# Altium schematic sheet button.SchDoc
size A4
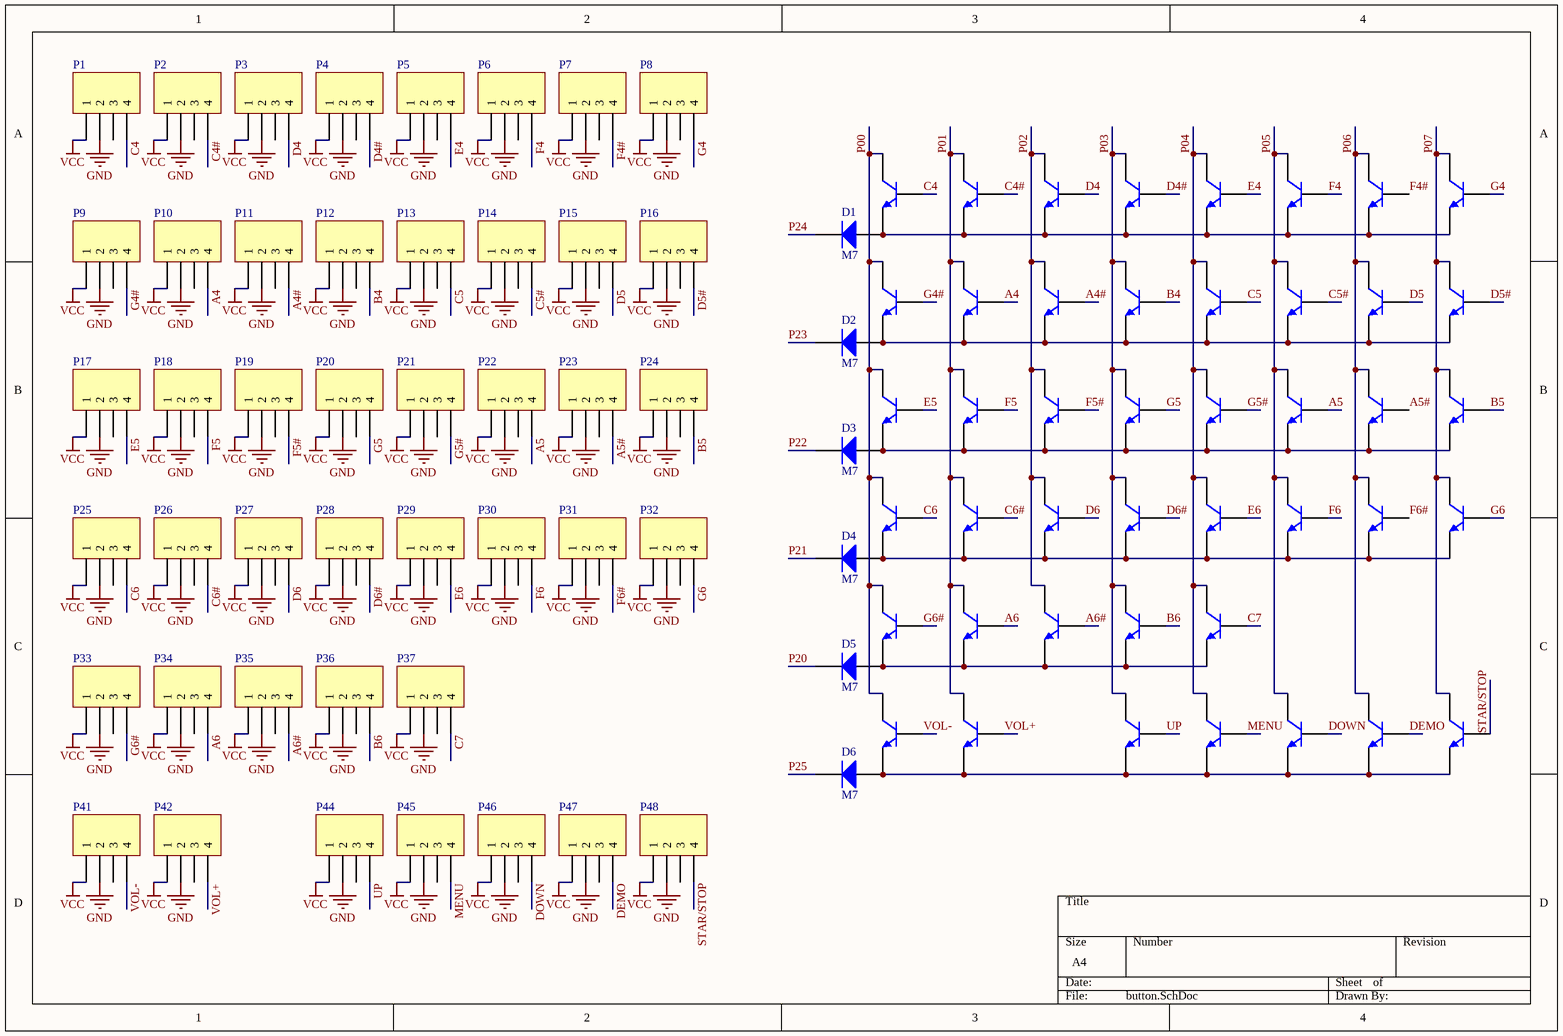
[diagram p0: button.SchDoc]

## Parts
D1  M7  [SMA(DO-214AC)_S1]
D2  M7  [SMA(DO-214AC)_S1]
D3  M7  [SMA(DO-214AC)_S1]
D4  M7  [SMA(DO-214AC)_S1]
D5  M7  [SMA(DO-214AC)_S1]
D6  M7  [SMA(DO-214AC)_S1]
P1  Header 4  [FPC1.0-2H-WS-4P]  (value not drawn)
P2  Header 4  [FPC1.0-2H-WS-4P]  (value not drawn)
P3  Header 4  [FPC1.0-2H-WS-4P]  (value not drawn)
P4  Header 4  [FPC1.0-2H-WS-4P]  (value not drawn)
P5  Header 4  [FPC1.0-2H-WS-4P]  (value not drawn)
P6  Header 4  [FPC1.0-2H-WS-4P]  (value not drawn)
P7  Header 4  [FPC1.0-2H-WS-4P]  (value not drawn)
P8  Header 4  [FPC1.0-2H-WS-4P]  (value not drawn)
P9  Header 4  [FPC1.0-2H-WS-4P]  (value not drawn)
P10  Header 4  [FPC1.0-2H-WS-4P]  (value not drawn)
P11  Header 4  [FPC1.0-2H-WS-4P]  (value not drawn)
P12  Header 4  [FPC1.0-2H-WS-4P]  (value not drawn)
P13  Header 4  [FPC1.0-2H-WS-4P]  (value not drawn)
P14  Header 4  [FPC1.0-2H-WS-4P]  (value not drawn)
P15  Header 4  [FPC1.0-2H-WS-4P]  (value not drawn)
P16  Header 4  [FPC1.0-2H-WS-4P]  (value not drawn)
P17  Header 4  [FPC1.0-2H-WS-4P]  (value not drawn)
P18  Header 4  [FPC1.0-2H-WS-4P]  (value not drawn)
P19  Header 4  [FPC1.0-2H-WS-4P]  (value not drawn)
P20  Header 4  [FPC1.0-2H-WS-4P]  (value not drawn)
P21  Header 4  [FPC1.0-2H-WS-4P]  (value not drawn)
P22  Header 4  [FPC1.0-2H-WS-4P]  (value not drawn)
P23  Header 4  [FPC1.0-2H-WS-4P]  (value not drawn)
P24  Header 4  [FPC1.0-2H-WS-4P]  (value not drawn)
P25  Header 4  [FPC1.0-2H-WS-4P]  (value not drawn)
P26  Header 4  [FPC1.0-2H-WS-4P]  (value not drawn)
P27  Header 4  [FPC1.0-2H-WS-4P]  (value not drawn)
P28  Header 4  [FPC1.0-2H-WS-4P]  (value not drawn)
P29  Header 4  [FPC1.0-2H-WS-4P]  (value not drawn)
P30  Header 4  [FPC1.0-2H-WS-4P]  (value not drawn)
P31  Header 4  [FPC1.0-2H-WS-4P]  (value not drawn)
P32  Header 4  [FPC1.0-2H-WS-4P]  (value not drawn)
P33  Header 4  [FPC1.0-2H-WS-4P]  (value not drawn)
P34  Header 4  [FPC1.0-2H-WS-4P]  (value not drawn)
P35  Header 4  [FPC1.0-2H-WS-4P]  (value not drawn)
P36  Header 4  [FPC1.0-2H-WS-4P]  (value not drawn)
P37  Header 4  [FPC1.0-2H-WS-4P]  (value not drawn)
P41  Header 4  [FPC1.0-2H-WS-4P]  (value not drawn)
P42  Header 4  [FPC1.0-2H-WS-4P]  (value not drawn)
P44  Header 4  [FPC1.0-2H-WS-4P]  (value not drawn)
P45  Header 4  [FPC1.0-2H-WS-4P]  (value not drawn)
P46  Header 4  [FPC1.0-2H-WS-4P]  (value not drawn)
P47  Header 4  [FPC1.0-2H-WS-4P]  (value not drawn)
P48  Header 4  [FPC1.0-2H-WS-4P]  (value not drawn)
Q1  SS8050 Y1  [SOT-23(SOT-23-3)]  (value not drawn)
Q2  SS8050 Y1  [SOT-23(SOT-23-3)]  (value not drawn)
Q3  SS8050 Y1  [SOT-23(SOT-23-3)]  (value not drawn)
Q4  SS8050 Y1  [SOT-23(SOT-23-3)]  (value not drawn)
Q5  SS8050 Y1  [SOT-23(SOT-23-3)]  (value not drawn)
Q6  SS8050 Y1  [SOT-23(SOT-23-3)]  (value not drawn)
Q7  SS8050 Y1  [SOT-23(SOT-23-3)]  (value not drawn)
Q8  SS8050 Y1  [SOT-23(SOT-23-3)]  (value not drawn)
Q9  SS8050 Y1  [SOT-23(SOT-23-3)]  (value not drawn)
Q10  SS8050 Y1  [SOT-23(SOT-23-3)]  (value not drawn)
Q11  SS8050 Y1  [SOT-23(SOT-23-3)]  (value not drawn)
Q12  SS8050 Y1  [SOT-23(SOT-23-3)]  (value not drawn)
Q13  SS8050 Y1  [SOT-23(SOT-23-3)]  (value not drawn)
Q14  SS8050 Y1  [SOT-23(SOT-23-3)]  (value not drawn)
Q15  SS8050 Y1  [SOT-23(SOT-23-3)]  (value not drawn)
Q16  SS8050 Y1  [SOT-23(SOT-23-3)]  (value not drawn)
Q17  SS8050 Y1  [SOT-23(SOT-23-3)]  (value not drawn)
Q18  SS8050 Y1  [SOT-23(SOT-23-3)]  (value not drawn)
Q19  SS8050 Y1  [SOT-23(SOT-23-3)]  (value not drawn)
Q20  SS8050 Y1  [SOT-23(SOT-23-3)]  (value not drawn)
Q21  SS8050 Y1  [SOT-23(SOT-23-3)]  (value not drawn)
Q22  SS8050 Y1  [SOT-23(SOT-23-3)]  (value not drawn)
Q23  SS8050 Y1  [SOT-23(SOT-23-3)]  (value not drawn)
Q24  SS8050 Y1  [SOT-23(SOT-23-3)]  (value not drawn)
Q25  SS8050 Y1  [SOT-23(SOT-23-3)]  (value not drawn)
Q26  SS8050 Y1  [SOT-23(SOT-23-3)]  (value not drawn)
Q27  SS8050 Y1  [SOT-23(SOT-23-3)]  (value not drawn)
Q28  SS8050 Y1  [SOT-23(SOT-23-3)]  (value not drawn)
Q29  SS8050 Y1  [SOT-23(SOT-23-3)]  (value not drawn)
Q30  SS8050 Y1  [SOT-23(SOT-23-3)]  (value not drawn)
Q31  SS8050 Y1  [SOT-23(SOT-23-3)]  (value not drawn)
Q32  SS8050 Y1  [SOT-23(SOT-23-3)]  (value not drawn)
Q33  SS8050 Y1  [SOT-23(SOT-23-3)]  (value not drawn)
Q34  SS8050 Y1  [SOT-23(SOT-23-3)]  (value not drawn)
Q35  SS8050 Y1  [SOT-23(SOT-23-3)]  (value not drawn)
Q36  SS8050 Y1  [SOT-23(SOT-23-3)]  (value not drawn)
Q37  SS8050 Y1  [SOT-23(SOT-23-3)]  (value not drawn)
Q38  SS8050 Y1  [SOT-23(SOT-23-3)]  (value not drawn)
Q39  SS8050 Y1  [SOT-23(SOT-23-3)]  (value not drawn)
Q40  SS8050 Y1  [SOT-23(SOT-23-3)]  (value not drawn)
Q41  SS8050 Y1  [SOT-23(SOT-23-3)]  (value not drawn)
Q42  SS8050 Y1  [SOT-23(SOT-23-3)]  (value not drawn)
Q43  SS8050 Y1  [SOT-23(SOT-23-3)]  (value not drawn)
Q44  SS8050 Y1  [SOT-23(SOT-23-3)]  (value not drawn)

## Nets
GND: P1.2 P2.2 P3.2 P4.2 P5.2 P6.2 P7.2 P8.2 P9.2 P10.2 P11.2 P12.2 P13.2 P14.2 P15.2 P16.2 P17.2 P18.2 P19.2 P20.2 P21.2 P22.2 P23.2 P24.2 P25.2 P26.2 P27.2 P28.2 P29.2 P30.2 P31.2 P32.2 P33.2 P34.2 P35.2 P36.2 P37.2 P41.2 P42.2 P44.2 P45.2 P46.2 P47.2 P48.2
VCC: P1.1 P2.1 P3.1 P4.1 P5.1 P6.1 P7.1 P8.1 P9.1 P10.1 P11.1 P12.1 P13.1 P14.1 P15.1 P16.1 P17.1 P18.1 P19.1 P20.1 P21.1 P22.1 P23.1 P24.1 P25.1 P26.1 P27.1 P28.1 P29.1 P30.1 P31.1 P32.1 P33.1 P34.1 P35.1 P36.1 P37.1 P41.1 P42.1 P44.1 P45.1 P46.1 P47.1 P48.1
A4: P10.4 Q10.1(B)
A4#: P11.4 Q11.1(B)
A5: P22.4 Q22.1(B)
A5#: P23.4 Q23.1(B)
A6: P34.4 Q34.1(B)
A6#: P35.4 Q35.1(B)
B4: P12.4 Q12.1(B)
B5: P24.4 Q24.1(B)
B6: P36.4 Q36.1(B)
C4: P1.4 Q1.1(B)
C4#: P2.4 Q2.1(B)
C5: P13.4 Q13.1(B)
C5#: P14.4 Q14.1(B)
C6: P25.4 Q25.1(B)
C6#: P26.4 Q26.1(B)
C7: P37.4 Q37.1(B)
D4: P3.4 Q3.1(B)
D4#: P4.4 Q4.1(B)
D5: P15.4 Q15.1(B)
D5#: P16.4 Q16.1(B)
D6: P27.4 Q27.1(B)
D6#: P28.4 Q28.1(B)
DEMO: P47.4 Q43.1(B)
DOWN: P46.4 Q42.1(B)
E4: P5.4 Q5.1(B)
E5: P17.4 Q17.1(B)
E6: P29.4 Q29.1(B)
F4: P6.4 Q6.1(B)
F4#: P7.4 Q7.1(B)
F5: P18.4 Q18.1(B)
F5#: P19.4 Q19.1(B)
F6: P30.4 Q30.1(B)
F6#: P31.4 Q31.1(B)
G4: P8.4 Q8.1(B)
G4#: P9.4 Q9.1(B)
G5: P20.4 Q20.1(B)
G5#: P21.4 Q21.1(B)
G6: P32.4 Q32.1(B)
G6#: P33.4 Q33.1(B)
MENU: P45.4 Q41.1(B)
P00: Q1.3(C) Q9.3(C) Q17.3(C) Q25.3(C) Q33.3(C) Q38.3(C)
P01: Q2.3(C) Q10.3(C) Q18.3(C) Q26.3(C) Q34.3(C) Q39.3(C)
P02: Q3.3(C) Q11.3(C) Q19.3(C) Q27.3(C) Q35.3(C)
P03: Q4.3(C) Q12.3(C) Q20.3(C) Q28.3(C) Q36.3(C) Q40.3(C)
P04: Q5.3(C) Q13.3(C) Q21.3(C) Q29.3(C) Q37.3(C) Q41.3(C)
P05: Q6.3(C) Q14.3(C) Q22.3(C) Q30.3(C) Q42.3(C)
P06: Q7.3(C) Q15.3(C) Q23.3(C) Q31.3(C) Q43.3(C)
P07: Q8.3(C) Q16.3(C) Q24.3(C) Q32.3(C) Q44.3(C)
P20: D5.2(K)
P21: D4.2(K)
P22: D3.2(K)
P23: D2.2(K)
P24: D1.2(K)
P25: D6.2(K)
STAR/STOP: P48.4 Q44.1(B)
UP: P44.4 Q40.1(B)
VOL+: P42.4 Q39.1(B)
VOL-: P41.4 Q38.1(B)
NetD1_1: D1.1(A) Q1.2(E) Q2.2(E) Q3.2(E) Q4.2(E) Q5.2(E) Q6.2(E) Q7.2(E) Q8.2(E)
NetD2_1: D2.1(A) Q9.2(E) Q10.2(E) Q11.2(E) Q12.2(E) Q13.2(E) Q14.2(E) Q15.2(E) Q16.2(E)
NetD3_1: D3.1(A) Q17.2(E) Q18.2(E) Q19.2(E) Q20.2(E) Q21.2(E) Q22.2(E) Q23.2(E) Q24.2(E)
NetD4_1: D4.1(A) Q25.2(E) Q26.2(E) Q27.2(E) Q28.2(E) Q29.2(E) Q30.2(E) Q31.2(E) Q32.2(E)
NetD5_1: D5.1(A) Q33.2(E) Q34.2(E) Q35.2(E) Q36.2(E) Q37.2(E)
NetD6_1: D6.1(A) Q38.2(E) Q39.2(E) Q40.2(E) Q41.2(E) Q42.2(E) Q43.2(E) Q44.2(E)

Not connected (* = marked no-connect by the designer): P1 3; P2 3; P3 3; P4 3; P5 3; P6 3; P7 3; P8 3; P9 3; P10 3; P11 3; P12 3; P13 3; P14 3; P15 3; P16 3; P17 3; P18 3; P19 3; P20 3; P21 3; P22 3; P23 3; P24 3; P25 3; P26 3; P27 3; P28 3; P29 3; P30 3; P31 3; P32 3; P33 3; P34 3; P35 3; P36 3; P37 3; P41 3; P42 3; P44 3; P45 3; P46 3; P47 3; P48 3

## Library data of the parts
D1-D6 = SMA(DO-214AC) M7: 二极管; 备注: 1N4007 4007 编号C2464 已经停售, 使用新物料编号C95872; ComponentLink1Description: 供应商链接; ComponentLink1URL: http://www.szlcsc.com/product/details_2841.html; Package: SMA(DO-214AC); Supplier: LC; SuppliersPartNumber: C95872
P1-P37 P41 P42 P44-P48 = Header 4: Header, 4-Pin; LatestRevisionDate: 17-Jul-2002; LatestRevisionNote: Re-released for DXP Platform.; Publisher: Altium Limited
Q1-Q44 = SOT-23 SS8050 Y1: 三极管; ComponentLink1Description: 供应商链接; ComponentLink1URL: http://www.szlcsc.com/product/details_2507.html; Package: SOT-23; Supplier: LC; SuppliersPartNumber: C2150